# Altium schematic sheet Microphone.SchDoc
size A4; SheetNumber: 3; SheetTotal: 3
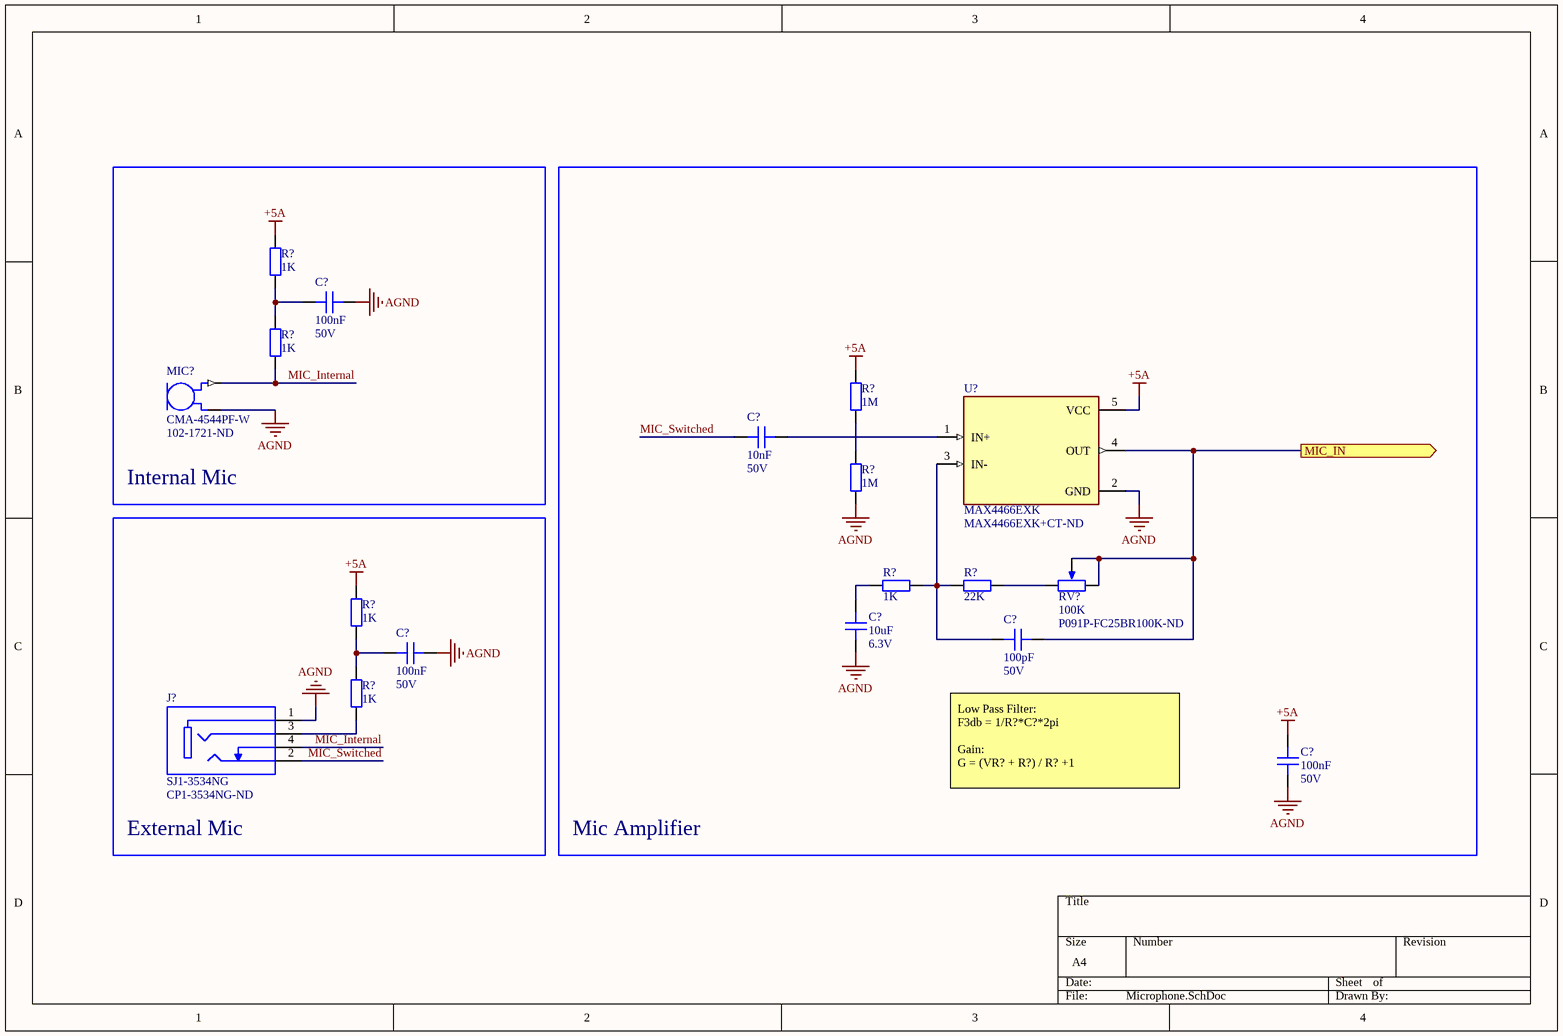
[diagram p0: Microphone.SchDoc]

## Parts
(Parts that share a designator on the sheet are numbered #1, #2 ... from top to bottom, then left to right.)
C?#1  value 100nF  Voltage: 50V  [CAP 0402/1005]  (hidden comment: Capacitor_SMD)
C?#2  value 10nF  Voltage: 50V  [CAP 0402/1005]  (hidden comment: Capacitor_SMD)
C?#3  value 10uF  Voltage: 6.3V  [CAP 0603/1608]  (hidden comment: Capacitor_SMD)
C?#4  value 100pF  Voltage: 50V  [CAP 0402/1005]  (hidden comment: Capacitor_SMD)
C?#5  value 100nF  Voltage: 50V  [CAP 0402/1005]  (hidden comment: Capacitor_SMD)
C?#6  value 100nF  Voltage: 50V  [CAP 0402/1005]  (hidden comment: Capacitor_SMD)
J?  SJ1-3534NG  Supplier Part Number 1: CP1-3534NG-ND  [CUI_SJ1-3534NG]
MIC?  CMA-4544PF-W  Supplier Part Number 1: 102-1721-ND  [MIC_CMA-4544PF-W]
R?#1  value 1K  [RES 0402/1005]  (hidden comment: Resistor_SMD)
R?#2  value 1K  [RES 0402/1005]  (hidden comment: Resistor_SMD)
R?#3  value 1M  [RES 0402/1005]  (hidden comment: Resistor_SMD)
R?#4  value 1M  [RES 0402/1005]  (hidden comment: Resistor_SMD)
R?#5  value 1K  [RES 0402/1005]  (hidden comment: Resistor_SMD)
R?#6  value 22K  [RES 0402/1005]  (hidden comment: Resistor_SMD)
R?#7  value 1K  [RES 0402/1005]  (hidden comment: Resistor_SMD)
R?#8  value 1K  [RES 0402/1005]  (hidden comment: Resistor_SMD)
RV?  value 100K  Supplier Part Number 1: P091P-FC25BR100K-ND  (hidden comment: P091P-FC25BR100K)
U?  MAX4466EXK  Supplier Part Number 1: MAX4466EXK+CT-ND  [SOT65P210X110-5N]

## Blocks framed on the sheet
Internal Mic: C?#1 MIC? R?#1 R?#2
Mic Amplifier: C?#2-C?#4 C?#6 R?#3-R?#6 RV? U?
External Mic: C?#5 J? R?#7 R?#8

## Ports
MIC_IN (out)

## Nets
+5A: C?#6.2 R?#1.2 R?#3.2 R?#7.2 U?.5(VCC)
AGND: C?#1.2 C?#3.1 C?#5.2 C?#6.1 J?.1 MIC?.2(GND) R?#4.1 U?.2(GND)
MIC_IN: C?#4.1 RV?.2(TAP) RV?.3 U?.4(OUT) ; port MIC_IN
MIC_Internal: J?.4 MIC?.1(OUT) R?#2.1
MIC_Switched: C?#2.1 J?.2
NetC?#1_1: C?#1.1 R?#1.1 R?#2.2
NetC?#2_2: C?#2.2 U?.1(IN+)
NetC?#3_2: C?#3.2 R?#5.2
NetC?#4_2: C?#4.2 R?#5.1 R?#6.2 U?.3(IN-)
NetC?#5_1: C?#5.1 R?#7.1 R?#8.2
NetJ?_3: J?.3 R?#8.1
NetR?#3_1: R?#3.1 R?#4.2
NetR?#6_1: R?#6.1 RV?.1

## Notes on the sheet
- Low Pass Filter:
  F3db = 1/R?*C?*2pi
  Gain:
  G = (VR? + R?) / R? +1

## Library data of the parts
C?#1-C?#6 = Capacitor_SMD: SMD Capacitor
J? = SJ1-3534NG: 3.5 mm, Stereo, Right Angle, Through Hole, Isolated Ground, Audio Jack Connector; MF: CUI Devices; SnapEDA_Link: https://www.snapeda.com/parts/SJ1-3534NG/CUI%20Devices/view-part/617954/?ref=snap; Price: None; MP: SJ1-3534NG; Package: None; Value: *; Availability: Unavailable; Supplier 1: Digi-Key
MIC? = CMA-4544PF-W: 9.7 mm, Omnidirectional, PCB Mount, 3.0 Vdc, Electret Condenser Microphone; MF: CUI Devices; CUI_purchase_URL: https://www.cuidevices.com/product/audio/microphones/electret-condenser-microphones/cma-4544pf-w?utm_source=snapeda.com&utm_medium=referral&utm_campaign=snapedaBOM; Price: None; SnapEDA_Link: https://www.snapeda.com/parts/CMA-4544PF-W/CUI%20Devices/view-part/215068/?ref=snap; Package: 6-DIP-6 CUI; Availability: Unavailable; Value: *; MP: CMA-4544PF-W; Supplier 1: Digi-Key
R?#1-R?#8 = Resistor_SMD: SMD Resistor; Power: 100mW
RV? = P091P-FC25BR100K: Potentiometer 9mm 100K ohm 20% Push Lock; Supplier 1: Digi-Key
U? = MAX4466EXK: Amplifier IC 1-Channel _Mono_ Class AB SC-70-5; MF: Maxim Integrated; MP: MAX4466EXK+T; Price: None; Value: *; Package: SC-70-5 Maxim; SnapEDA_Link: https://www.snapeda.com/parts/MAX4466EXK%2BT/Maxim%20Integrated/view-part/548008/?ref=snap; Availability: Unavailable; Supplier 1: Digi-Key